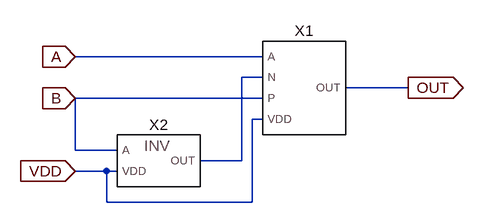
[diagram p0: schematic XORgdi.asc]
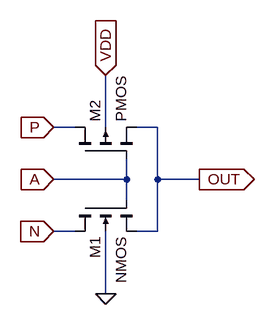
[diagram p1: sub-circuit gdicell.asc]
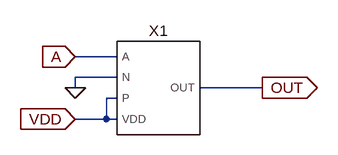
[diagram p2: sub-circuit invgdi.asc]
XORgdi.asc, the LTspice schematic file:
Version 4
SHEET 1 880 680
WIRE 160 80 -128 80
WIRE 160 112 128 112
WIRE 384 128 288 128
WIRE 160 144 -128 144
WIRE 160 176 144 176
WIRE -128 224 -128 144
WIRE -64 224 -128 224
WIRE 128 240 128 112
WIRE 128 240 64 240
WIRE -80 256 -128 256
WIRE -64 256 -80 256
WIRE -80 304 -80 256
WIRE 144 304 144 176
WIRE 144 304 -80 304
FLAG -128 80 A
IOPIN -128 80 In
FLAG -128 144 B
IOPIN -128 144 In
FLAG 384 128 OUT
IOPIN 384 128 Out
FLAG -128 256 VDD
IOPIN -128 256 In
SYMBOL GDICell 224 128 R0
SYMATTR InstName X1
SYMBOL INVgdi 0 240 R0
SYMATTR InstName X2

gdicell.asc, the sub-circuit schematic file:
Version 4
SHEET 1 880 680
WIRE 176 96 144 96
WIRE 224 96 224 16
WIRE 304 96 272 96
WIRE 256 176 256 144
WIRE 256 176 144 176
WIRE 304 176 304 96
WIRE 368 176 304 176
WIRE 256 208 256 176
WIRE 176 256 144 256
WIRE 304 256 304 176
WIRE 304 256 272 256
WIRE 224 352 224 256
FLAG 144 96 P
IOPIN 144 96 In
FLAG 144 256 N
IOPIN 144 256 In
FLAG 144 176 A
IOPIN 144 176 In
FLAG 368 176 OUT
IOPIN 368 176 Out
FLAG 224 16 VDD
IOPIN 224 16 In
FLAG 224 352 0
SYMBOL nmos4 176 208 M90
SYMATTR InstName M1
SYMATTR Value2 l=65nm w=65nm
SYMBOL pmos4 176 144 R270
SYMATTR InstName M2
SYMATTR Value2 l=162.5nm w=65nm

invgdi.asc, the sub-circuit schematic file:
Version 4
SHEET 1 880 680
WIRE 176 112 112 112
WIRE 176 144 112 144
WIRE 112 160 112 144
WIRE 400 160 304 160
WIRE 176 176 160 176
WIRE 160 208 160 176
WIRE 160 208 112 208
WIRE 176 208 160 208
FLAG 112 112 A
IOPIN 112 112 In
FLAG 112 208 VDD
IOPIN 112 208 In
FLAG 400 160 OUT
IOPIN 400 160 Out
FLAG 112 160 0
SYMBOL GDICell 240 160 R0
SYMATTR InstName X1

The netlist it stands for:
* XORgdi.asc
XX1 A N001 B VDD OUT gdicell
XX2 B VDD N001 invgdi

* block symbol definitions
.subckt gdicell A N P VDD OUT
M1 N A OUT 0 NMOS l=65nm w=65nm
M2 P A OUT VDD PMOS l=162.5nm w=65nm
.ends gdicell

.subckt invgdi A VDD OUT
XX1 A 0 VDD VDD OUT gdicell
.ends invgdi

.model NMOS NMOS
.model PMOS PMOS
.lib standard.mos
.backanno
.end